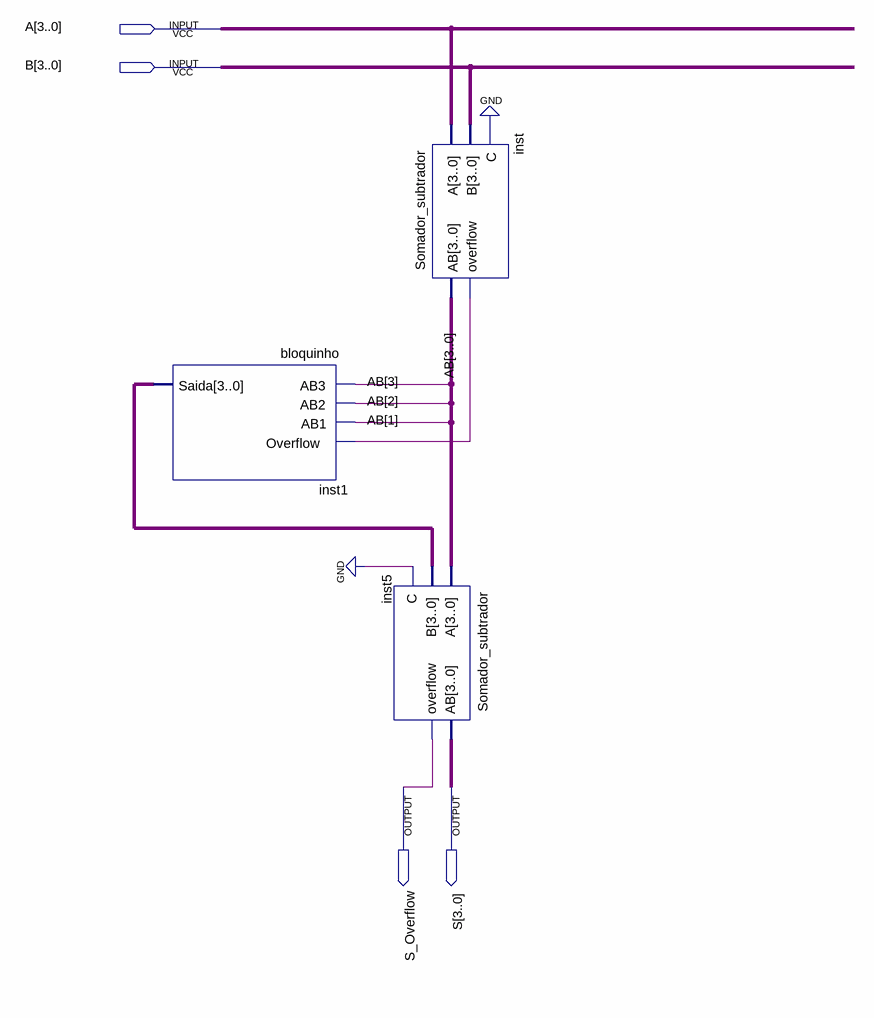
[diagram p0: schematic sheet]
// Quartus schematic BCDSomador.bdf as structural Verilog: 3 symbols, 4 pins
module BCDSomador (
  input  [3:0] A,
  input  [3:0] B,
  output S_Overflow,
  output [3:0] S
);

  wire inst_overflow;
  wire [3:0] AB, inst1_saida;

  bloquinho inst1 (.AB3(AB[3]), .AB2(AB[2]), .AB1(AB[1]), .Overflow(inst_overflow), .Saida(inst1_saida));
  Somador_subtrador inst (.A(A), .B(B), .C(1'b0), .AB(AB), .overflow(inst_overflow));
  Somador_subtrador inst5 (.A(AB), .B(inst1_saida), .C(1'b0), .AB(S), .overflow(S_Overflow));
endmodule
